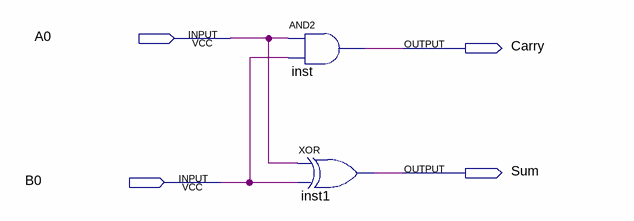
[diagram p0: schematic sheet]
// Quartus schematic halfadder.bdf as structural Verilog: 2 symbols, 4 pins
module halfadder (
  input  A0,
  input  B0,
  output Carry,
  output Sum
);

  and inst (Carry, A0, B0);
  xor inst1 (Sum, A0, B0);
endmodule
